# Altium schematic sheet 7 M.2 Wi-Fi.SchDoc
size 594 x 420 mm; SheetNumber: 8; SheetTotal: 9
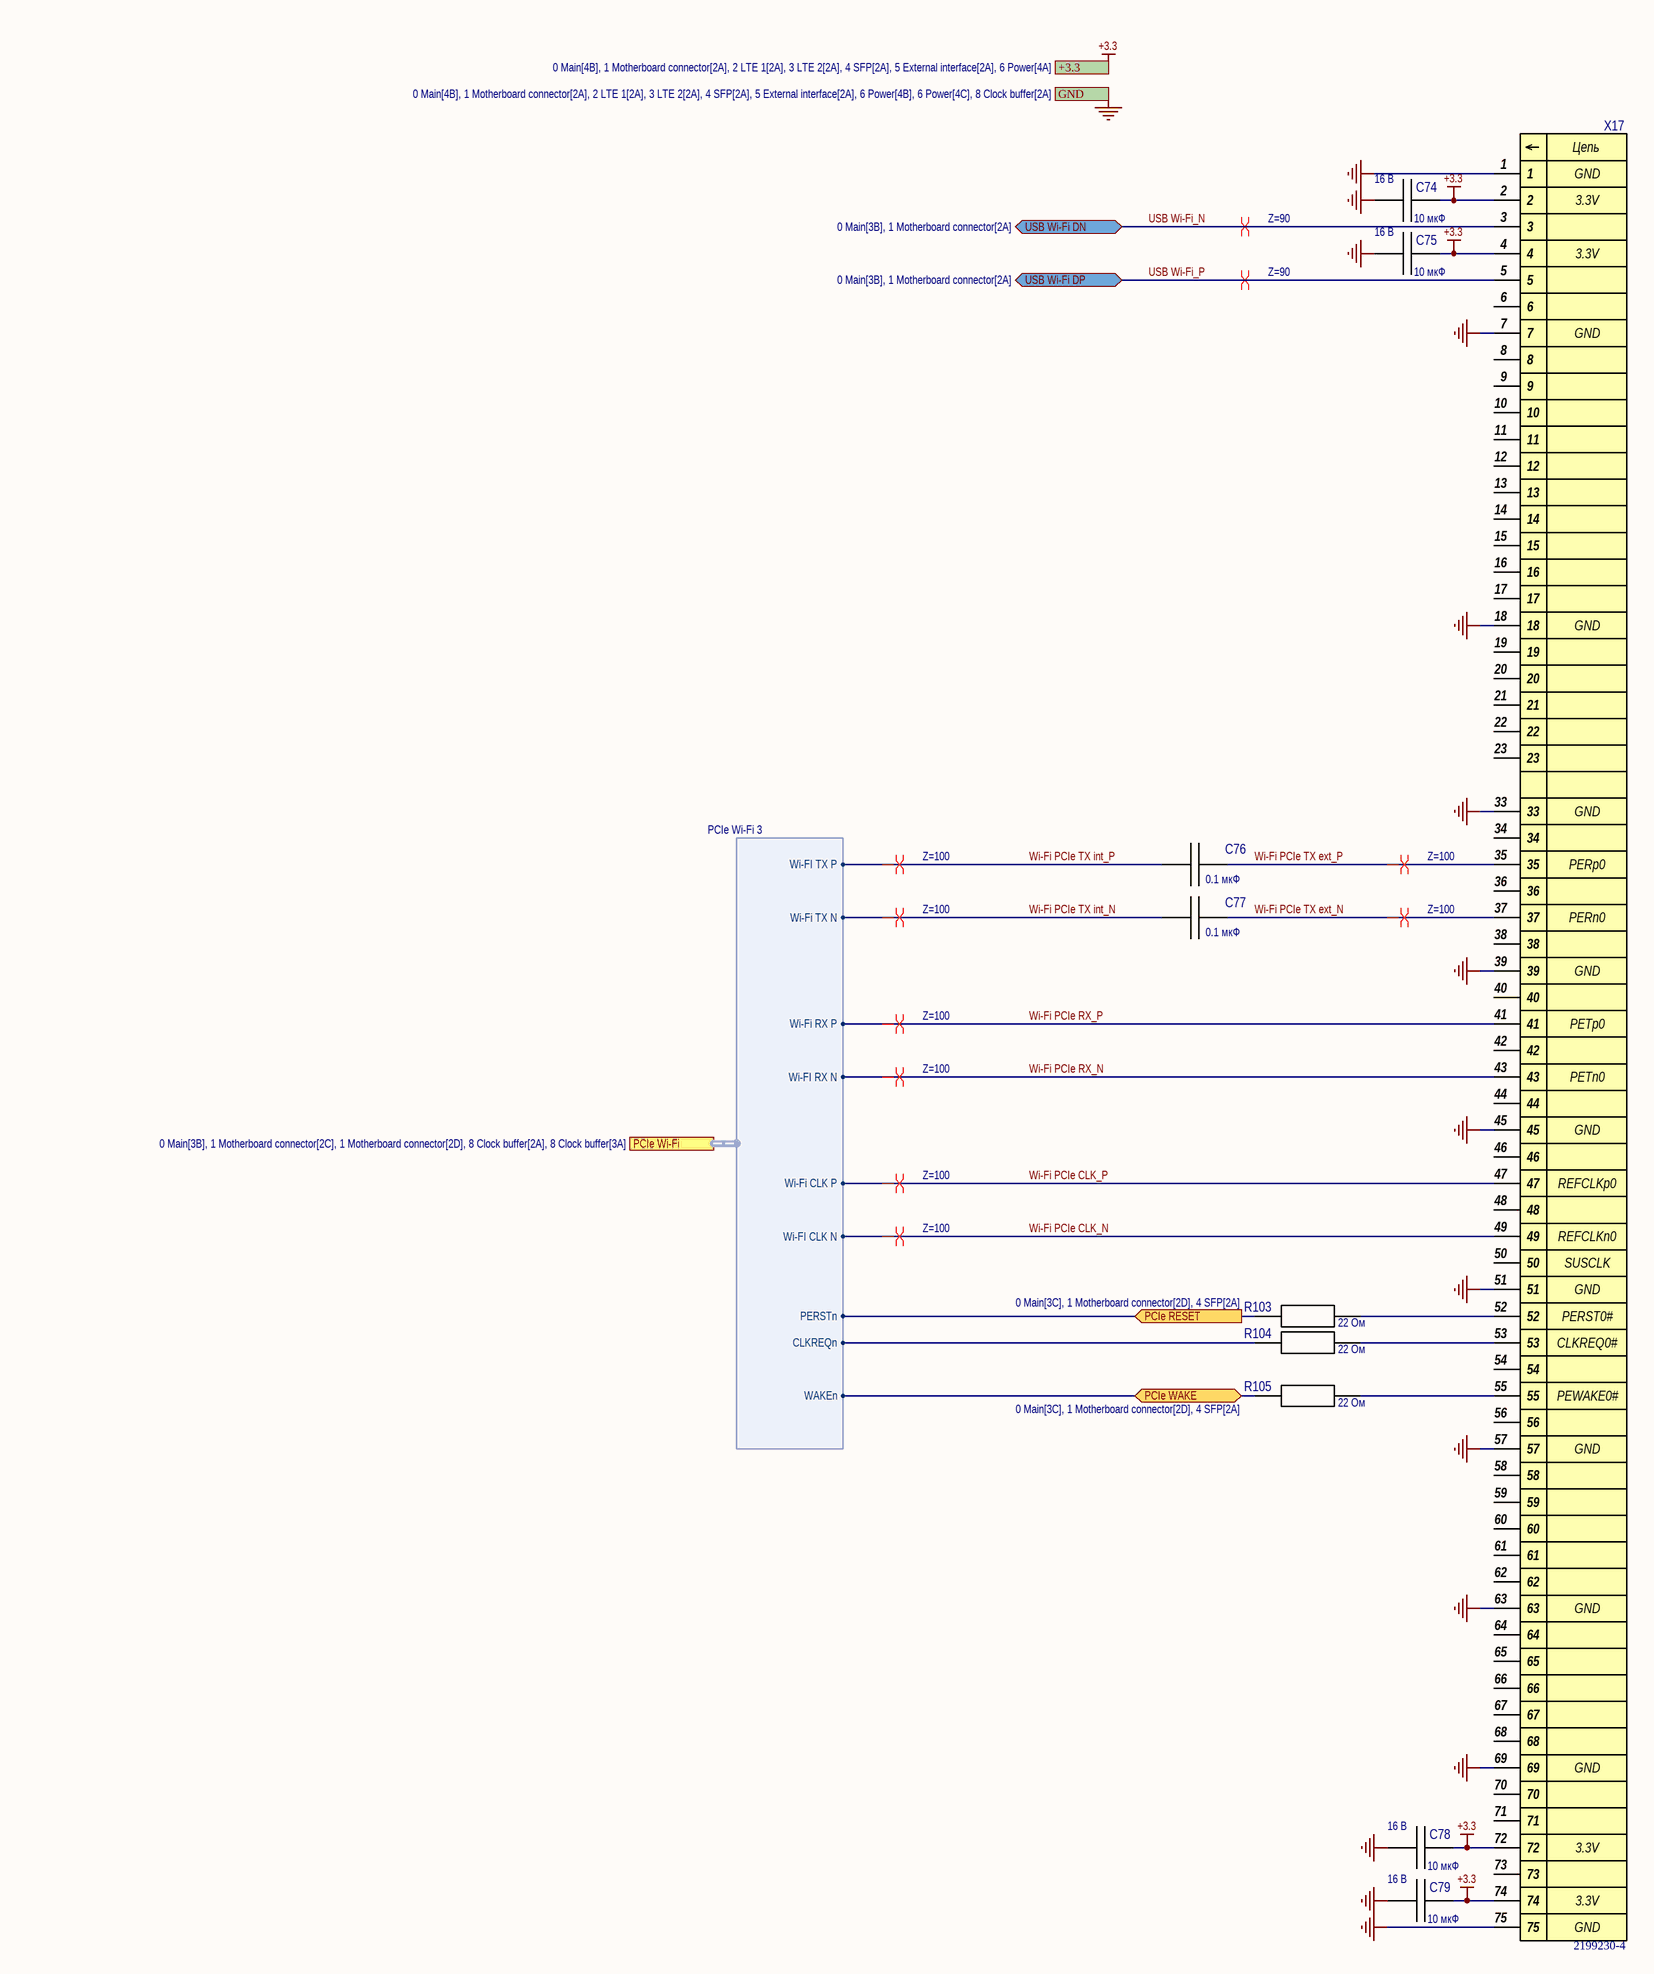
[diagram p0: 7 M.2 Wi-Fi.SchDoc]

## Parts
C74  value 10 мкФ  Напряжение: 16 В  [CAP_0805]
C75  value 10 мкФ  Напряжение: 16 В  [CAP_0805]
C76  value 0.1 мкФ  [CAP_0402]
C77  value 0.1 мкФ  [CAP_0402]
C78  value 10 мкФ  Напряжение: 16 В  [CAP_0805]
C79  value 10 мкФ  Напряжение: 16 В  [CAP_0805]
R103  value 22 Ом  [RES_0402]  (hidden comment: STD_RES)
R104  value 22 Ом  [RES_0402]  (hidden comment: STD_RES)
R105  value 22 Ом  [RES_0402]  (hidden comment: STD_RES)
X17  2199230-4  [2199230-4]

## Ports
+3.3 (see 0 Main[4B], 1 Motherboard connector[2A], 2 LTE 1[2A], 3 LTE 2[2A], 4 SFP[2A], 5 External interface[2A], 6 Power[4A]), GND (see 0 Main[4B], 1 Motherboard connector[2A], 2 LTE 1[2A], 3 LTE 2[2A], 4 SFP[2A], 5 External interface[2A], 6 Power[4B], 6 Power[4C], 8 Clock buffer[2A]), PCIe RESET (in, see 0 Main[3C], 1 Motherboard connector[2D], 4 SFP[2A]), PCIe WAKE (bidir, see 0 Main[3C], 1 Motherboard connector[2D], 4 SFP[2A]), PCIe Wi-Fi (harness PCIe Wi-Fi 3, see 0 Main[3B], 1 Motherboard connector[2C], 1 Motherboard connector[2D], 8 Clock buffer[2A], 8 Clock buffer[3A]), USB Wi-Fi DN (bidir, see 0 Main[3B], 1 Motherboard connector[2A]), USB Wi-Fi DP (bidir, see 0 Main[3B], 1 Motherboard connector[2A])

## Harnesses
PCIe Wi-Fi 3: Wi-FI TX P, Wi-Fi TX N, Wi-Fi RX P, Wi-FI RX N, Wi-Fi CLK P, Wi-FI CLK N, PERSTn, CLKREQn, WAKEn

## Nets
+3.3: C74.1 C75.1 C78.1 C79.1 X17.2 X17.4 X17.72 X17.74 ; port +3.3
GND: C74.2 C75.2 C78.2 C79.2 X17.1 X17.7 X17.18 X17.33 X17.39 X17.45 X17.51 X17.57 X17.63 X17.69 X17.75 ; port GND
PCIe RESET: R103.2 ; port PCIe RESET, port PCIe Wi-Fi.PERSTn
PCIe WAKE: R105.2 ; port PCIe WAKE, port PCIe Wi-Fi.WAKEn
USB Wi-Fi_N: X17.3 ; port USB Wi-Fi DN
USB Wi-Fi_P: X17.5 ; port USB Wi-Fi DP
Wi-Fi PCIe CLK_N: X17.49 ; port PCIe Wi-Fi.Wi-FI CLK N
Wi-Fi PCIe CLK_P: X17.47 ; port PCIe Wi-Fi.Wi-Fi CLK P
Wi-Fi PCIe RX_N: X17.43 ; port PCIe Wi-Fi.Wi-FI RX N
Wi-Fi PCIe RX_P: X17.41 ; port PCIe Wi-Fi.Wi-Fi RX P
Wi-Fi PCIe TX ext_N: C77.1 X17.37
Wi-Fi PCIe TX ext_P: C76.1 X17.35
Wi-Fi PCIe TX int_N: C77.2 ; port PCIe Wi-Fi.Wi-Fi TX N
Wi-Fi PCIe TX int_P: C76.2 ; port PCIe Wi-Fi.Wi-FI TX P
NetR103_1: R103.1 X17.52
NetR104_1: R104.1 X17.53
NetR104_2: R104.2 ; port PCIe Wi-Fi.CLKREQn
NetR105_1: R105.1 X17.55

Not connected (* = marked no-connect by the designer): X17 6 8 9 10 11 12 13 14 15 16 17 19 20 21 22 23 34 36 38 40 42 44 46 48 50 54 56 58 59 60 61 62 64 65 66 67 68 70 71 73

## Layout directives
differential pair; differential pair class Z=90: USB Wi-Fi_N, USB Wi-Fi_P
differential pair; differential pair class Z=100: Wi-Fi PCIe CLK_N, Wi-Fi PCIe CLK_P, Wi-Fi PCIe RX_N, Wi-Fi PCIe RX_P, Wi-Fi PCIe TX ext_N, Wi-Fi PCIe TX ext_P, Wi-Fi PCIe TX int_N, Wi-Fi PCIe TX int_P

## Notes on the sheet
- Перв. примен.
- Справ. №
- Подп. и дата
- Инв. № дубл.
- Взам. инв. №
- Инв. № подл.
- Изм.
- Лист
- № докум.
- Подп.
- Дата
- 2.106-A2
- Копировал
- Формат А2
- (in symbol 2199230-4) Цепь; GND; 3.3V; PERp0; PERn0; PETp0; PETn0; REFCLKp0; REFCLKn0; SUSCLK; PERST0#; CLKREQ0#; PEWAKE0#

## Library data of the parts
C74 C75 C78 C79 = GRM21BR61C106KE15L: Конденсатор CHIP-0805 10 мкФ 16 В 10% X5R; Manufacturer: MURATA; ID: 121; Температура: -55...+85°C; Autor: Цислав А.Н.; PartNumber: GRM21BR61C106KE15L; Type: CHIP-0805; Tolerance: 10%; Диэлектрик: X5R; Data: 09-05-2013
C76 C77 = GRM155R71E104KE14: Конденсатор CHIP-0402 0.1 мкФ 25 В 10% X7R; Manufacturer: MURATA; ID: 234; Напряжение: 25 В; Температура: -55...+125°C; Autor: Admin; PartNumber: GRM155R71E104KE14; Type: CHIP-0402; Tolerance: 10%; Диэлектрик: X7R; Data: 01-15-2018
R103-R105 = RC0402FR-0722RL: Резистор CHIP-0402 22 Ом 1%; Manufacturer: YAGEO; ID: 272; ТКС: 100 ppm/K; Температура: -55...+155°C; Autor: Цислав А.Н.; PartNumber: RC0402FR-0722RL; Type: CHIP-0402; Tolerance: 1%; Data: 02-03-2014
X17 = 2199230-4: Разъем TE M.2 NGFF; ID: 339; Contact: 75; Pitch: 0.5 мм; Current: 100 мА; Autor: Admin; PartNumber: 2199230-4; Type: M.2; Mounting: Поверхностный; Manufacturer: TE; Data: 11-21-2023